# EAGLE design motherboard (EAGLE 9.2.0)
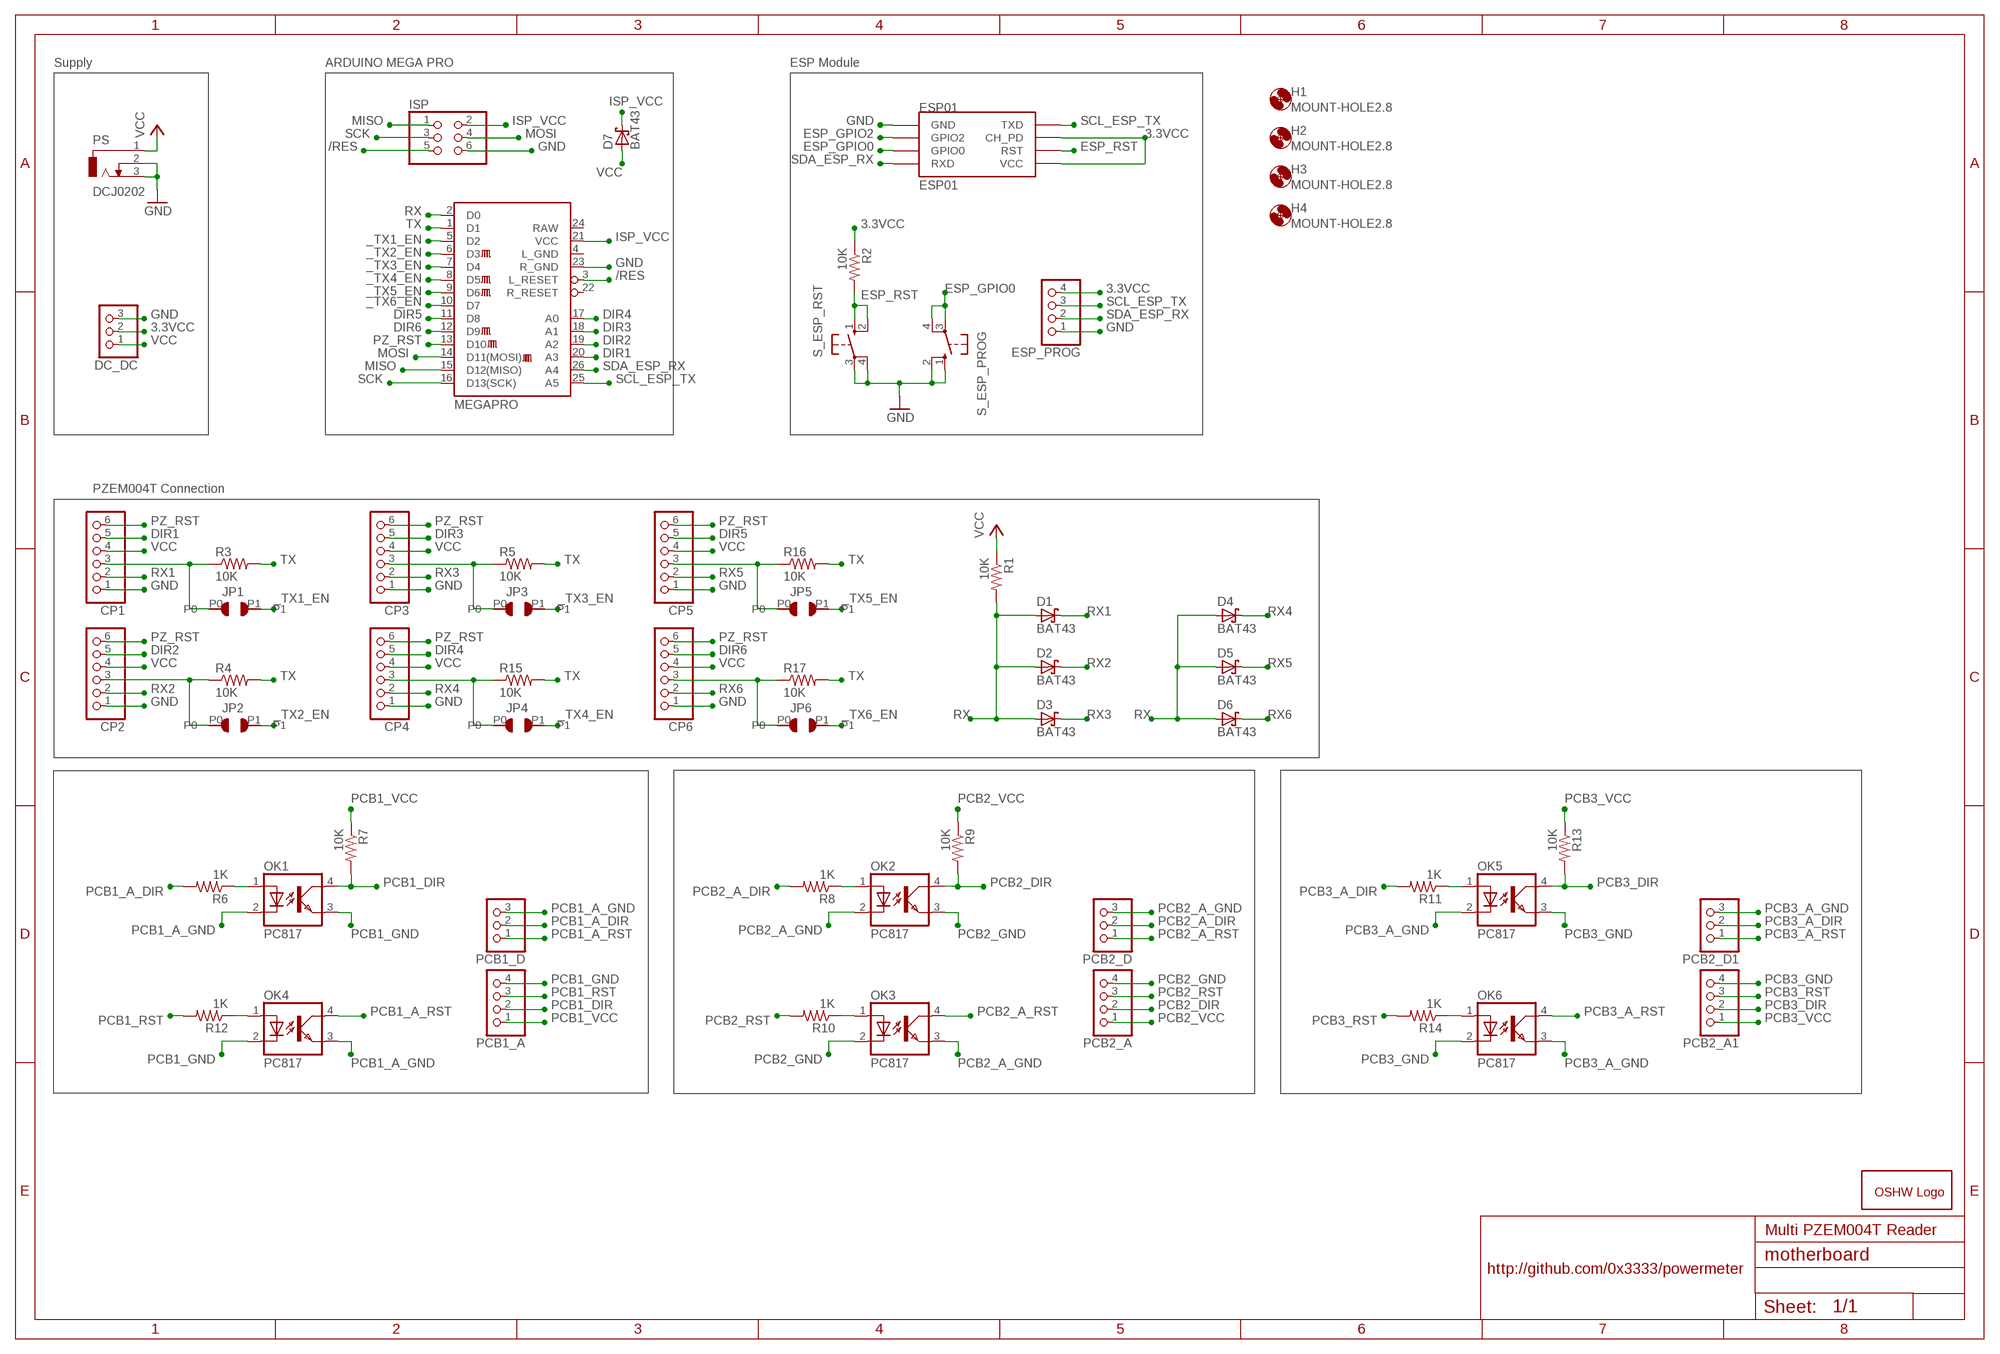
[diagram p0: schematic, sheet 1]

## Parts
CP1  PINHD-1X6  [1X06]
CP2  PINHD-1X6  [1X06]
CP3  PINHD-1X6  [1X06]
CP4  PINHD-1X6  [1X06]
CP5  PINHD-1X6  [1X06]
CP6  PINHD-1X6  [1X06]
D1  BAT43  BAT60J  [SOD323_ST]
D2  BAT43  BAT60J  [SOD323_ST]
D3  BAT43  BAT60J  [SOD323_ST]
D4  BAT43  BAT60J  [SOD323_ST]
D5  BAT43  BAT60J  [SOD323_ST]
D6  BAT43  BAT60J  [SOD323_ST]
D7  BAT43  BAT60J  [SOD323_ST]
DC_DC  PINHD-1X3  [1X03]
ESP01  ESP01  [ESP01]
ESP_PROG  PINHD-1X4  [1X04]
GOLD_ORB_SM1  OSHWLOGOLOGO8MM  [OSHW_8MM]
H1  MOUNT-HOLE2.8  [2,8]
H2  MOUNT-HOLE2.8  [2,8]
H3  MOUNT-HOLE2.8  [2,8]
H4  MOUNT-HOLE2.8  [2,8]
ISP  PINHD-2X3  [2X03]
JP1  SMD_JUMPER  [SMD_JUMPER]
JP2  SMD_JUMPER  [SMD_JUMPER]
JP3  SMD_JUMPER  [SMD_JUMPER]
JP4  SMD_JUMPER  [SMD_JUMPER]
JP5  SMD_JUMPER  [SMD_JUMPER]
JP6  SMD_JUMPER  [SMD_JUMPER]
MEGAPRO  ARDUINO_PRO_MINI  [ARDUINO_PRO_MINI]
OK1  PC817  [DIL04]
OK2  PC817  [DIL04]
OK3  PC817  [DIL04]
OK4  PC817  [DIL04]
OK5  PC817  [DIL04]
OK6  PC817  [DIL04]
PCB1_A  PINHD-1X4  [1X04]
PCB1_D  PINHD-1X3  [1X03]
PCB2_A  PINHD-1X4  [1X04]
PCB2_A1  PINHD-1X4  [1X04]
PCB2_D  PINHD-1X3  [1X03]
PCB2_D1  PINHD-1X3  [1X03]
PS  DCJ0202  [DCJ0202]
R1  10K  R-US_R1206W  [R1206W]
R2  10K  R-US_R0805  [R0805]
R3  10K  R-US_R1206W  [R1206W]
R4  10K  R-US_R1206W  [R1206W]
R5  10K  R-US_R1206W  [R1206W]
R6  1K  R-US_R0805  [R0805]
R7  10K  R-US_R0805  [R0805]
R8  1K  R-US_R0805  [R0805]
R9  10K  R-US_R0805  [R0805]
R10  1K  R-US_R0805  [R0805]
R11  1K  R-US_R0805  [R0805]
R12  1K  R-US_R0805  [R0805]
R13  10K  R-US_R0805  [R0805]
R14  1K  R-US_R0805  [R0805]
R15  10K  R-US_R1206W  [R1206W]
R16  10K  R-US_R1206W  [R1206W]
R17  10K  R-US_R1206W  [R1206W]
S_ESP_PROG  10-XX  [B3F-10XX]
S_ESP_RST  10-XX  [B3F-10XX]

## Nets
3.3VCC: DC_DC.2 ESP01.CH_PD ESP01.VCC ESP_PROG.4 R2.1
/RES: ISP.5 MEGAPRO.3(L_RESET)
_TX1_EN: JP1.P1 MEGAPRO.5(D2)
_TX2_EN: JP2.P1 MEGAPRO.6(D3)
_TX3_EN: JP3.P1 MEGAPRO.7(D4)
_TX4_EN: JP4.P1 MEGAPRO.8(D5)
_TX5_EN: JP5.P1 MEGAPRO.9(D6)
_TX6_EN: JP6.P1 MEGAPRO.10(D7)
DIR1: CP1.5 MEGAPRO.20(A3)
DIR2: CP2.5 MEGAPRO.19(A2)
DIR3: CP3.5 MEGAPRO.18(A1)
DIR4: CP4.5 MEGAPRO.17(A0)
DIR5: CP5.5 MEGAPRO.11(D8)
DIR6: CP6.5 MEGAPRO.12(D9)
ESP_GPIO0: ESP01.GPIO0 S_ESP_PROG.3(P) S_ESP_PROG.4(P1)
ESP_GPIO2: ESP01.GPIO2
ESP_RST: ESP01.RST R2.2 S_ESP_RST.1(S) S_ESP_RST.2(S1)
GND: CP1.1 CP2.1 CP3.1 CP4.1 CP5.1 CP6.1 DC_DC.3 ESP01.GND ESP_PROG.1 ISP.6 MEGAPRO.23(R_GND) PS.2 PS.3 S_ESP_PROG.1(S) S_ESP_PROG.2(S1) S_ESP_RST.3(P) S_ESP_RST.4(P1)
ISP_VCC: D7.C ISP.2 MEGAPRO.21(VCC)
MISO: ISP.1 MEGAPRO.15(D12(MISO))
MOSI: ISP.4 MEGAPRO.14(D11(MOSI))
N$1: CP1.3 JP1.P0 R3.1
N$2: CP2.3 JP2.P0 R4.1
N$3: OK1.1(A) R6.1
N$4: CP3.3 JP3.P0 R5.1
N$5: OK2.1(A) R8.1
N$6: OK3.1(A) R10.1
N$7: OK5.1(A) R11.1
N$8: OK6.1(A) R14.1
N$9: CP4.3 JP4.P0 R15.1
N$10: CP5.3 JP5.P0 R16.1
N$11: CP6.3 JP6.P0 R17.1
N$14: OK4.1(A) R12.1
PCB1_A_DIR: PCB1_D.2 R6.2
PCB1_A_GND: OK1.2(C) OK4.3(EMIT) PCB1_D.3
PCB1_A_RST: OK4.4(COL) PCB1_D.1
PCB1_DIR: OK1.4(COL) PCB1_A.2 R7.2
PCB1_GND: OK1.3(EMIT) OK4.2(C) PCB1_A.4
PCB1_RST: PCB1_A.3 R12.2
PCB1_VCC: PCB1_A.1 R7.1
PCB2_A_DIR: PCB2_D.2 R8.2
PCB2_A_GND: OK2.2(C) OK3.3(EMIT) PCB2_D.3
PCB2_A_RST: OK3.4(COL) PCB2_D.1
PCB2_DIR: OK2.4(COL) PCB2_A.2 R9.2
PCB2_GND: OK2.3(EMIT) OK3.2(C) PCB2_A.4
PCB2_RST: PCB2_A.3 R10.2
PCB2_VCC: PCB2_A.1 R9.1
PCB3_A_DIR: PCB2_D1.2 R11.2
PCB3_A_GND: OK5.2(C) OK6.3(EMIT) PCB2_D1.3
PCB3_A_RST: OK6.4(COL) PCB2_D1.1
PCB3_DIR: OK5.4(COL) PCB2_A1.2 R13.2
PCB3_GND: OK5.3(EMIT) OK6.2(C) PCB2_A1.4
PCB3_RST: PCB2_A1.3 R14.2
PCB3_VCC: PCB2_A1.1 R13.1
PZ_RST: CP1.6 CP2.6 CP3.6 CP4.6 CP5.6 CP6.6 MEGAPRO.13(D10)
RX: D1.A D2.A D3.A D4.A D5.A D6.A MEGAPRO.2(D0) R1.2
RX1: CP1.2 D1.C
RX2: CP2.2 D2.C
RX3: CP3.2 D3.C
RX4: CP4.2 D4.C
RX5: CP5.2 D5.C
RX6: CP6.2 D6.C
SCK: ISP.3 MEGAPRO.16(D13(SCK))
SCL_ESP_TX: ESP01.TX(TXD) ESP_PROG.3 MEGAPRO.25(A5)
SDA_ESP_RX: ESP01.RX(RXD) ESP_PROG.2 MEGAPRO.26(A4)
TX: MEGAPRO.1(D1) R3.2 R4.2 R5.2 R15.2 R16.2 R17.2
VCC: CP1.4 CP2.4 CP3.4 CP4.4 CP5.4 CP6.4 D7.A DC_DC.1 PS.1 R1.1
Unconnected: MEGAPRO.4(L_GND) MEGAPRO.22(R_RESET) MEGAPRO.24(RAW)

## Notes on the sheet
- Supply | ARDUINO MEGA PRO | ESP Module
- PZEM004T Connection
- Multi PZEM004T Reader
- http://github.com/0x3333/powermeter

## Library data of the parts
CP1-CP6 = pinhead:PINHD-1X6: PIN HEADER
D1-D7 = diode:BAT60J: Schottky barrier diode Source: www.st.com, BAT60J.pdf
DC_DC PCB1_D PCB2_D PCB2_D1 = pinhead:PINHD-1X3: PIN HEADER
ESP01 = esp8266modules:ESP01: ESP8266 Wifi module 01
ESP_PROG PCB1_A PCB2_A PCB2_A1 = pinhead:PINHD-1X4: PIN HEADER
GOLD_ORB_SM1 = oshw:OSHWLOGO: The OSHW logo for PCB layout
H1-H4 = holes:MOUNT-HOLE: MOUNTING HOLE with drill center marker
ISP = pinhead:PINHD-2X3: PIN HEADER
JP1-JP6 = EPIC:SMD_JUMPER
MEGAPRO = EPIC:ARDUINO_PRO_MINI
OK1-OK6 = optocoupler:PC817: SHARP OPTO COUPLER; MPN: PC817X4J000F; OC_FARNELL: 9707727; OC_NEWARK: 97K7059
PS = con-jack:DCJ0202: DC POWER JACK Source: DCJ0202.pdf; OC_FARNELL: unknown; OC_NEWARK: unknown
R1-R17 = resistor:R-US_: RESISTOR, American symbol
S_ESP_PROG S_ESP_RST = switch-omron:10-XX: OMRON SWITCH; MPN: B3F-1000; OC_FARNELL: 176432; OC_NEWARK: 36M3542

## Board
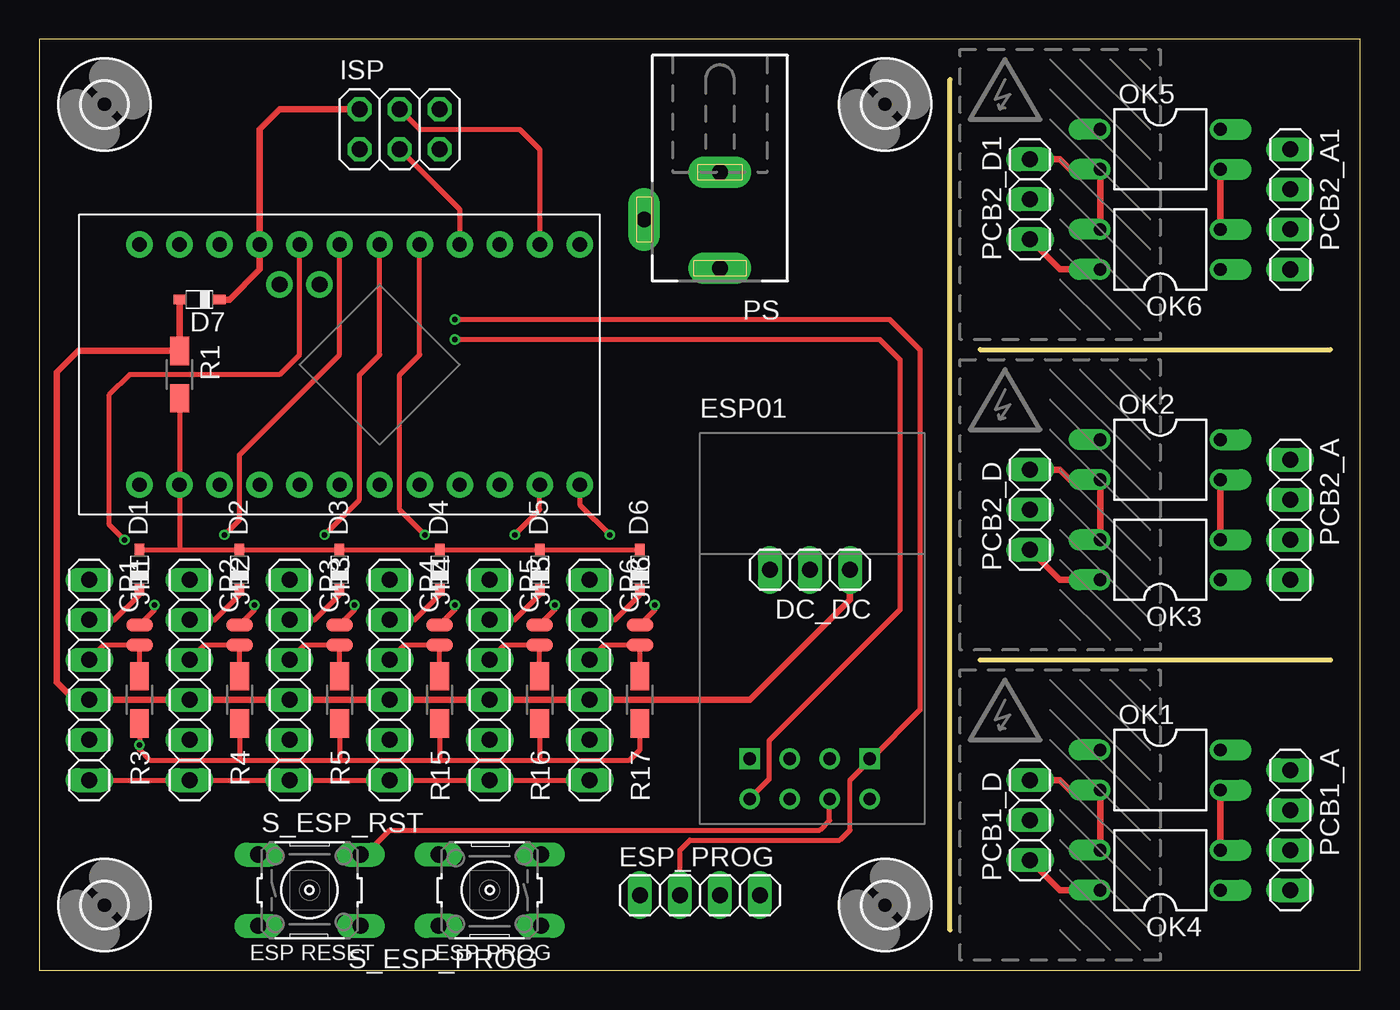
[diagram p1: board, top side]
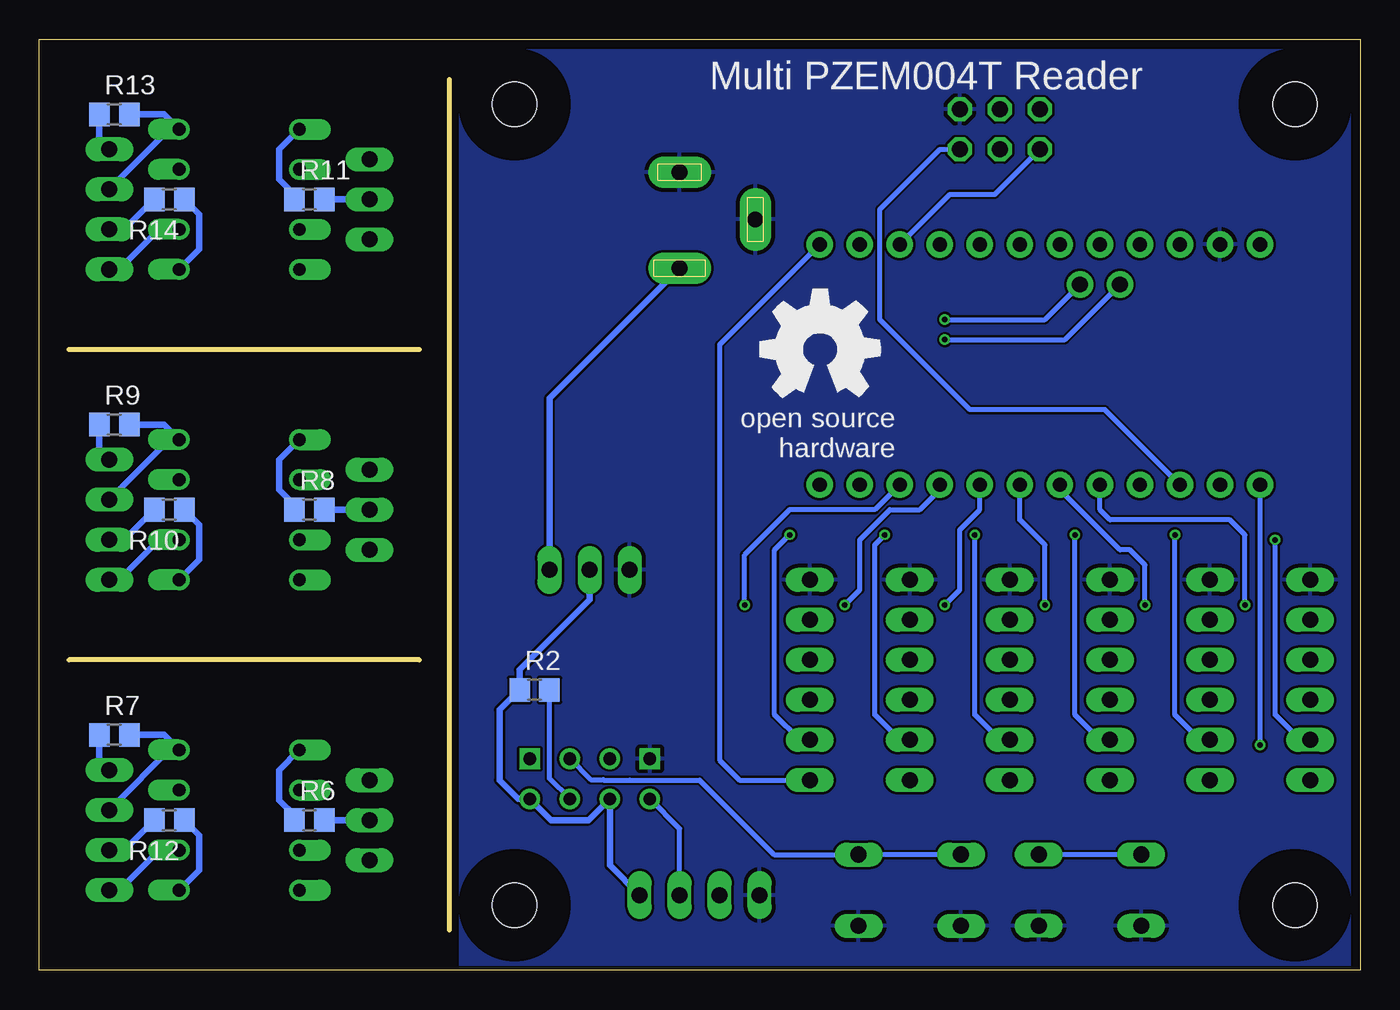
[diagram p2: board, bottom side, seen from below]

Size 83.81 x 59.05 mm. Coordinates in mm from the lower left corner, seen from the top.
Outline: 0,0 83.81,0 83.81,59.05 0,59.05 0,0
Copper layers (1*16): Top 0.035mm / dielectric 1.5mm / Bottom 0.035mm
Design rules "SeeedStudio_2layer_DRU_no_angle_20140221": minimum track width 6mil, minimum drill 12mil, track to track 6mil, track to pad 6mil, pad to pad 6mil, via to via 6mil, smd to smd 0mil, copper to edge 10mil, drill to drill 10mil, minimum pad ring 10mil, minimum via ring 6mil, stop-mask expansion 2mil, vias tented up to drill 100mil, thermal gap 10mil
Milling: 3 lines

### Footprints (pad centres in the part's own frame; a part is rotated, then mirrored left to right if it is on the bottom)
1X06 = drill 1.016 long: 1 -6.35,0; 2 -3.81,0; 3 -1.27,0; 4 1.27,0; 5 3.81,0; 6 6.35,0
SOD323_ST = smd 0.8 x 0.6: A 1.25,0; C -1.25,0
1X03 = drill 1.016 long: 1 -2.54,0; 2 0,0; 3 2.54,0
ESP01 = drill 0.8: CH_PD -1.285,-8.178; GPIO0 1.255,-5.638; GPIO2 -1.285,-5.638; RST 1.255,-8.178; TX -3.825,-8.178; VCC 3.795,-8.178 | drill 0.8 square: GND -3.825,-5.638; RX 3.795,-5.638
1X04 = drill 1.016 long: 1 -3.81,0; 2 -1.27,0; 3 1.27,0; 4 3.81,0
2,8 = hole 2.8: 0,0
2X03 = drill 1.016 octagon: 1 -2.54,-1.27; 2 -2.54,1.27; 3 0,-1.27; 4 0,1.27; 5 2.54,-1.27; 6 2.54,1.27
SMD_JUMPER = smd 0.813 x 1.676: P0 -0.635,0; P1 0.635,0
ARDUINO_PRO_MINI = drill 0.9 pad 1.676: 1 -7.62,12.7; 2 -7.62,10.16; 3 -7.62,7.62; 4 -7.62,5.08; 5 -7.62,2.54; 6 -7.62,0; 7 -7.62,-2.54; 8 -7.62,-5.08; 9 -7.62,-7.62; 10 -7.62,-10.16; 11 -7.62,-12.7; 12 -7.62,-15.24; 13 7.62,-15.24; 14 7.62,-12.7; 15 7.62,-10.16; 16 7.62,-7.62; 17 7.62,-5.08; 18 7.62,-2.54; 19 7.62,0; 20 7.62,2.54; 21 7.62,5.08; 22 7.62,7.62; 23 7.62,10.16; 24 7.62,12.7 | drill 1 pad 1.676: 25 5.08,3.81; 26 5.08,1.27
DIL04 = drill 0.813 offset: 1 -1.27,-3.81; 2 1.27,-3.81; 3 1.27,3.81; 4 -1.27,3.81
DCJ0202 = drill 1 pad 2 long: 1 0,3.1; 2 4.8,0; 3 0,-3
R1206W = smd 1.8 x 1.2: 1 -1.499,0; 2 1.499,0
R0805 = smd 1.3 x 1.5: 1 -0.95,0; 2 0.95,0
B3F-10XX = drill 1.016 long: 1 -3.251,2.261; 2 3.251,2.261; 3 -3.251,-2.261; 4 3.251,-2.261

### Placement (x,y rotation side)
CP1  3.17,18.41 270 top
CP2  9.53,18.41 270 top
CP3  15.88,18.41 270 top
CP4  22.23,18.41 270 top
CP5  28.57,18.41 270 top
CP6  34.92,18.41 270 top
D1  6.35,25.4 90 top
D2  12.7,25.4 90 top
D3  19.05,25.4 90 top
D4  25.4,25.4 90 top
D5  31.75,25.4 90 top
D6  38.1,25.4 90 top
D7  10.16,42.55 180 top
DC_DC  48.9,25.4 180 top
ESP01  48.9,19.05 0 top
ESP_PROG  41.91,4.76 0 top
GOLD_ORB_SM1  34.29,39.37 0 bottom
H1  53.66,54.93 0 top
H2  53.66,4.13 0 top
H3  4.13,54.93 0 top
H4  4.13,4.13 0 top
ISP  22.86,53.34 0 top
JP1  6.35,21.27 90 top
JP2  12.7,21.27 90 top
JP3  19.05,21.27 90 top
JP4  25.4,21.27 90 top
JP5  31.75,21.27 90 top
JP6  38.1,21.27 90 top
MEGAPRO  19.05,38.42 90 top
OK1  71.12,12.7 270 top
OK2  71.12,32.38 270 top
OK3  71.12,26.04 90 top
OK4  71.12,6.35 90 top
OK5  71.12,52.07 270 top
OK6  71.12,45.72 90 top
PCB1_A  79.38,8.89 270 top
PCB1_D  62.87,9.53 90 top
PCB2_A  79.38,28.57 270 top
PCB2_A1  79.38,48.26 270 top
PCB2_D  62.87,29.21 90 top
PCB2_D1  62.87,48.9 90 top
PS  43.18,47.62 180 top
R1  8.89,37.78 270 top
R2  52.39,17.78 0 bottom
R3  6.35,17.14 270 top
R4  12.7,17.14 270 top
R5  19.05,17.14 270 top
R6  66.67,9.53 0 bottom
R7  79.06,14.92 0 bottom
R8  66.67,29.21 0 bottom
R9  79.06,34.61 0 bottom
R10  75.56,29.21 180 bottom
R11  66.67,48.9 0 bottom
R12  75.56,9.53 180 bottom
R13  79.06,54.29 0 bottom
R14  75.56,48.9 180 bottom
R15  25.4,17.14 270 top
R16  31.75,17.14 270 top
R17  38.1,17.14 270 top
S_ESP_PROG  28.57,5.08 180 top
S_ESP_RST  17.14,5.08 0 top

### Tracks (layer width: path | path; a pad name or v marks a point on that pad's centre or on a via)
3.3VCC
  Bottom 0.305: R2.1
  Bottom 0.406: ESP_PROG.4 47.61,6.65 ESP01.CH_PD 48.96,9.53 51.34,9.53 | DC_DC.2 48.9,23.5 53.34,19.05 R2.1 54.61,16.51 54.61,12.06 53.42,10.87 ESP01.VCC 51.34,9.53 | 51.34,9.53
/RES
  Bottom 0.305: MEGAPRO.3 16.19,35.56 24.77,35.56 30.48,41.27 30.48,48.26 26.67,52.07 ISP.5
_TX1_EN  (via drill 0.35)
  Top 0.305: JP1.P1 7.3,22.86 v7.3,23.18
  Bottom 0.305: v7.3,23.18 7.3,27.62 8.26,28.57 15.88,28.57 16.51,29.21 MEGAPRO.5
_TX2_EN  (via drill 0.35)
  Top 0.305: JP2.P1 13.65,22.86 v13.65,23.18
  Bottom 0.305: v13.65,23.18 13.65,25.72 14.61,26.67 15.24,26.67 19.05,30.48 MEGAPRO.6
_TX3_EN  (via drill 0.35)
  Top 0.305: JP3.P1 20,22.86 v20,23.18
  Bottom 0.305: v20,23.18 20,26.99 21.59,28.57 MEGAPRO.7
_TX4_EN  (via drill 0.35)
  Top 0.305: JP4.P1 26.35,22.86 v26.35,23.18
  Bottom 0.305: v26.35,23.18 25.4,24.13 25.4,27.94 24.13,29.21 MEGAPRO.8
_TX5_EN  (via drill 0.35)
  Top 0.305: JP5.P1 32.7,22.86 v32.7,23.18
  Bottom 0.305: v32.7,23.18 31.75,24.13 31.75,27.3 29.84,29.21 27.94,29.21 26.67,30.48 MEGAPRO.9
_TX6_EN  (via drill 0.35)
  Top 0.305: JP6.P1 39.05,22.86 v39.05,23.18
  Bottom 0.305: v39.05,23.18 39.05,26.35 36.2,29.21 30.8,29.21 MEGAPRO.10
DIR1  (via drill 0.35)
  Top 0.305: v5.4,27.3 4.45,28.26 4.45,36.51 5.71,37.78 15.24,37.78 16.51,39.05 MEGAPRO.20
  Bottom 0.305: CP1.5 3.81,14.61 5.4,16.19 v5.4,27.3
DIR2  (via drill 0.35)
  Top 0.305: v11.75,27.62 12.7,28.57 12.7,32.7 19.05,39.05 MEGAPRO.19
  Bottom 0.305: CP2.5 10.16,14.61 11.75,16.19 v11.75,27.62
DIR3  (via drill 0.35)
  Top 0.305: v18.1,27.62 20.32,29.84 20.32,37.78 21.59,39.05 MEGAPRO.18
  Bottom 0.305: CP3.5 16.51,14.61 18.1,16.19 v18.1,27.62
DIR4  (via drill 0.35)
  Top 0.305: v24.45,27.62 22.86,29.21 22.86,37.78 24.13,39.05 MEGAPRO.17
  Bottom 0.305: CP4.5 22.86,14.61 24.45,16.19 v24.45,27.62
DIR5  (via drill 0.35)
  Top 0.305: v30.16,27.62 31.75,29.21 MEGAPRO.11
  Bottom 0.305: CP5.5 29.21,14.61 30.8,16.19 30.8,26.99 v30.16,27.62
DIR6  (via drill 0.35)
  Top 0.305: MEGAPRO.12 34.29,29.53 v36.2,27.62
  Bottom 0.305: CP6.5 35.56,14.61 37.15,16.19 37.15,26.67 v36.2,27.62
ESP_GPIO0
  Bottom 0.305: ESP01.GPIO0 48.82,12.08 48.03,12.08 48.01,12.06 46.35,12.06 41.91,12.06 37.19,7.34 S_ESP_PROG.3 S_ESP_PROG.4
ESP_RST
  Top 0.305: S_ESP_RST.2 20.68,7.34 22.23,8.89 49.53,8.89 50.15,9.51 ESP01.RST
  Bottom 0.305: S_ESP_RST.1 S_ESP_RST.2 | ESP01.RST 51.44,12.16 51.44,15.88 R2.2
GND
  pour Bottom: 0.64,58.42 0.64,0 57.15,0 57.15,58.42
ISP_VCC
  Top 0.406: ISP.2 15.24,54.61 13.97,53.34 MEGAPRO.21 13.97,44.45 12.06,42.55 D7.C
MISO
  Bottom 0.305: MEGAPRO.15 26.04,49.21 23.18,49.21 ISP.1
MOSI
  Top 0.305: ISP.4 24.13,53.34 30.48,53.34 31.75,52.07 MEGAPRO.14
N$1
  Top 0.305: R3.1 JP1.P0 4.13,20.64 CP1.3
N$2
  Top 0.305: R4.1 JP2.P0 10.48,20.64 CP2.3
N$3
  Bottom 0.406: R6.1 67.62,9.84 68.58,10.79 68.58,12.7 OK1.1
N$4
  Top 0.305: R5.1 JP3.P0 16.83,20.64 CP3.3
N$5
  Bottom 0.406: R8.1 67.94,29.53 67.94,29.84 68.58,30.48 68.58,32.38 OK2.1
N$6
  Bottom 0.406: R10.1 73.66,28.25 73.66,26.04 OK3.1
N$7
  Bottom 0.406: R11.1 67.94,49.22 67.94,49.53 68.58,50.16 68.58,52.07 OK5.1
N$8
  Bottom 0.406: R14.1 73.66,47.94 73.66,45.72 OK6.1
N$9
  Top 0.305: R15.1 JP4.P0 23.18,20.64 CP4.3
N$10
  Top 0.305: R16.1 JP5.P0 29.53,20.64 CP5.3
N$11
  Top 0.305: R17.1 JP6.P0 35.88,20.64 CP6.3
N$14
  Bottom 0.406: OK4.1 73.66,6.35 73.66,8.57 R12.1
PCB1_A_DIR
  Bottom 0.406: R6.2 PCB1_D.2
PCB1_A_GND
  Top 0.406: PCB1_D.3 64.77,12.06 65.41,11.43 OK1.2 OK4.3
PCB1_A_RST
  Top 0.406: PCB1_D.1 64.77,5.08 OK4.4
PCB1_DIR
  Bottom 0.406: R7.2 75.88,14.92 75.25,14.29 | 75.25,14.29 OK1.4 | PCB1_A.2 75.25,14.29
PCB1_GND
  Top 0.406: OK1.3 OK4.2
  Bottom 0.406: PCB1_A.4 78.74,5.08 76.2,7.62 OK4.2
PCB1_RST
  Bottom 0.406: R12.2 78.42,7.62 PCB1_A.3
PCB1_VCC
  Bottom 0.406: R7.1 80.01,13.33 PCB1_A.1
PCB2_A_DIR
  Bottom 0.406: R8.2 PCB2_D.2
PCB2_A_GND
  Top 0.406: PCB2_D.3 64.77,31.75 65.41,31.11 OK2.2 OK3.3
PCB2_A_RST
  Top 0.406: PCB2_D.1 64.77,24.77 OK3.4
PCB2_DIR
  Bottom 0.406: R9.2 75.88,34.61 75.25,33.97 | 75.25,33.97 OK2.4 | PCB2_A.2 75.25,33.97
PCB2_GND
  Top 0.406: OK2.3 OK3.2
  Bottom 0.406: OK3.2 76.2,27.3 78.74,24.77 PCB2_A.4
PCB2_RST
  Bottom 0.406: R10.2 78.42,27.3 PCB2_A.3
PCB2_VCC
  Bottom 0.406: PCB2_A.1 80.01,33.02 R9.1
PCB3_A_DIR
  Bottom 0.406: R11.2 PCB2_D1.2
PCB3_A_GND
  Top 0.406: PCB2_D1.3 64.77,51.44 65.41,50.8 OK5.2 OK6.3
PCB3_A_RST
  Top 0.406: PCB2_D1.1 64.77,44.45 OK6.4
PCB3_DIR
  Bottom 0.406: R13.2 75.88,54.29 75.25,53.66 | 75.25,53.66 OK5.4 | PCB2_A1.2 75.25,53.66
PCB3_GND
  Top 0.406: OK5.3 OK6.2
  Bottom 0.406: OK6.2 76.2,46.99 78.74,44.45 PCB2_A1.4
PCB3_RST
  Bottom 0.406: R14.2 78.42,46.99 PCB2_A1.3
PCB3_VCC
  Bottom 0.406: R13.1 80.01,52.7 PCB2_A1.1
PZ_RST
  Top 0.305: CP1.6 CP2.6 CP3.6 CP4.6 CP5.6 CP6.6
  Bottom 0.305: CP6.6 39.37,12.06 40.64,13.34 40.64,39.69 MEGAPRO.13
RX
  Top 0.305: D1.A 6.37,26.67 8.89,26.67 | 8.89,26.67 12.7,26.67 | 12.7,26.67 19.05,26.67 | 19.05,26.67 25.4,26.67 | 25.4,26.67 31.75,26.67 | 31.75,26.67 36.2,26.67 36.22,26.65 D6.A | D2.A 12.7,26.67 | D3.A 19.05,26.67 | D4.A 25.4,26.67 | D5.A 31.75,26.67 | 8.89,26.67 8.89,30.48 MEGAPRO.2 R1.2
RX1
  Top 0.305: CP1.2 4.76,22.23 6.35,23.81 D1.C
RX2
  Top 0.305: CP2.2 11.11,22.23 12.7,23.81 D2.C
RX3
  Top 0.305: CP3.2 17.46,22.23 19.05,23.81 D3.C
RX4
  Top 0.305: CP4.2 23.81,22.23 25.4,23.81 D4.C
RX5
  Top 0.305: CP5.2 30.16,22.23 31.75,23.81 D5.C
RX6
  Top 0.305: CP6.2 36.51,22.23 38.1,23.81 D6.C
SCK
  Top 0.305: ISP.3 26.67,48.26 MEGAPRO.16
SCL_ESP_TX  (via drill 0.35)
  Top 0.305: v26.35,40.01 53.34,40.01 54.61,38.73 54.61,22.86 46.31,14.56 46.31,12.11 ESP01.TX
  Bottom 0.305: ESP01.TX 43.18,8.98 ESP_PROG.3 | MEGAPRO.25 18.73,40.01 v26.35,40.01
SDA_ESP_RX  (via drill 0.35)
  Top 0.305: ESP_PROG.2 40.64,7.62 41.27,8.26 50.8,8.26 51.44,8.89 51.44,12.06 52.69,13.32 | 52.69,13.32 ESP01.RX | v26.35,41.27 53.98,41.27 55.88,39.37 55.88,16.51 52.69,13.32
  Bottom 0.305: MEGAPRO.26 20,41.27 v26.35,41.27
TX  (via drill 0.35)
  Top 0.305: 12.7,13.34 6.99,13.34 6.35,13.97 v6.35,14.29 R3.2 | 12.7,13.34 19.05,13.34 | 19.05,13.34 25.4,13.34 | 25.4,13.34 31.75,13.34 | 31.75,13.34 37.46,13.34 38.1,13.97 R17.2 | R4.2 12.7,13.34 | R5.2 19.05,13.34 | R15.2 25.4,13.34 | R16.2 31.75,13.34
  Bottom 0.305: MEGAPRO.1 v6.35,14.29
VCC
  Top 0.305: 2.22,17.14 CP1.4
  Top 0.406: CP1.4 CP2.4 CP3.4 CP4.4 CP5.4 CP6.4 45.09,17.14 51.44,23.5 DC_DC.1 | 2.22,17.14 1.11,18.26 1.11,37.94 2.45,39.28 R1.1 8.89,42.52 D7.A
  Bottom 0.406: DC_DC.1 51.44,36.27 PS.1

### Text on the board
tNames: ESP RESET | ESP PROG
bNames: Multi PZEM004T Reader
tValues: GND | VCC | DIR | DIR | RST | RST | GND | GND | VCC | DIR | DIR | RST | RST | GND | GND | VCC | DIR | DIR | RST | RST | GND
tDocu: VCC | DIR | RST | GND | High / Voltage | VCC | DIR | RST | GND | High / Voltage | VCC | DIR | CH1 | CH2 | CH3 | CH4 | CH5 | CH6 | ESP ISP | RST | GND | GND | RX | TX | 3.3V | High / Voltage
bDocu: Rev. 1 | GND | DIR | RST | GND | DIR | RST | GND | TX | RX | VCC | DIR | GND | GPIO2 | GPIO0 | RX | RST | GND | TX | CH/PD | RST | 3.3V | DIR | RST